# EAGLE design em_probe (EAGLE 6.2)
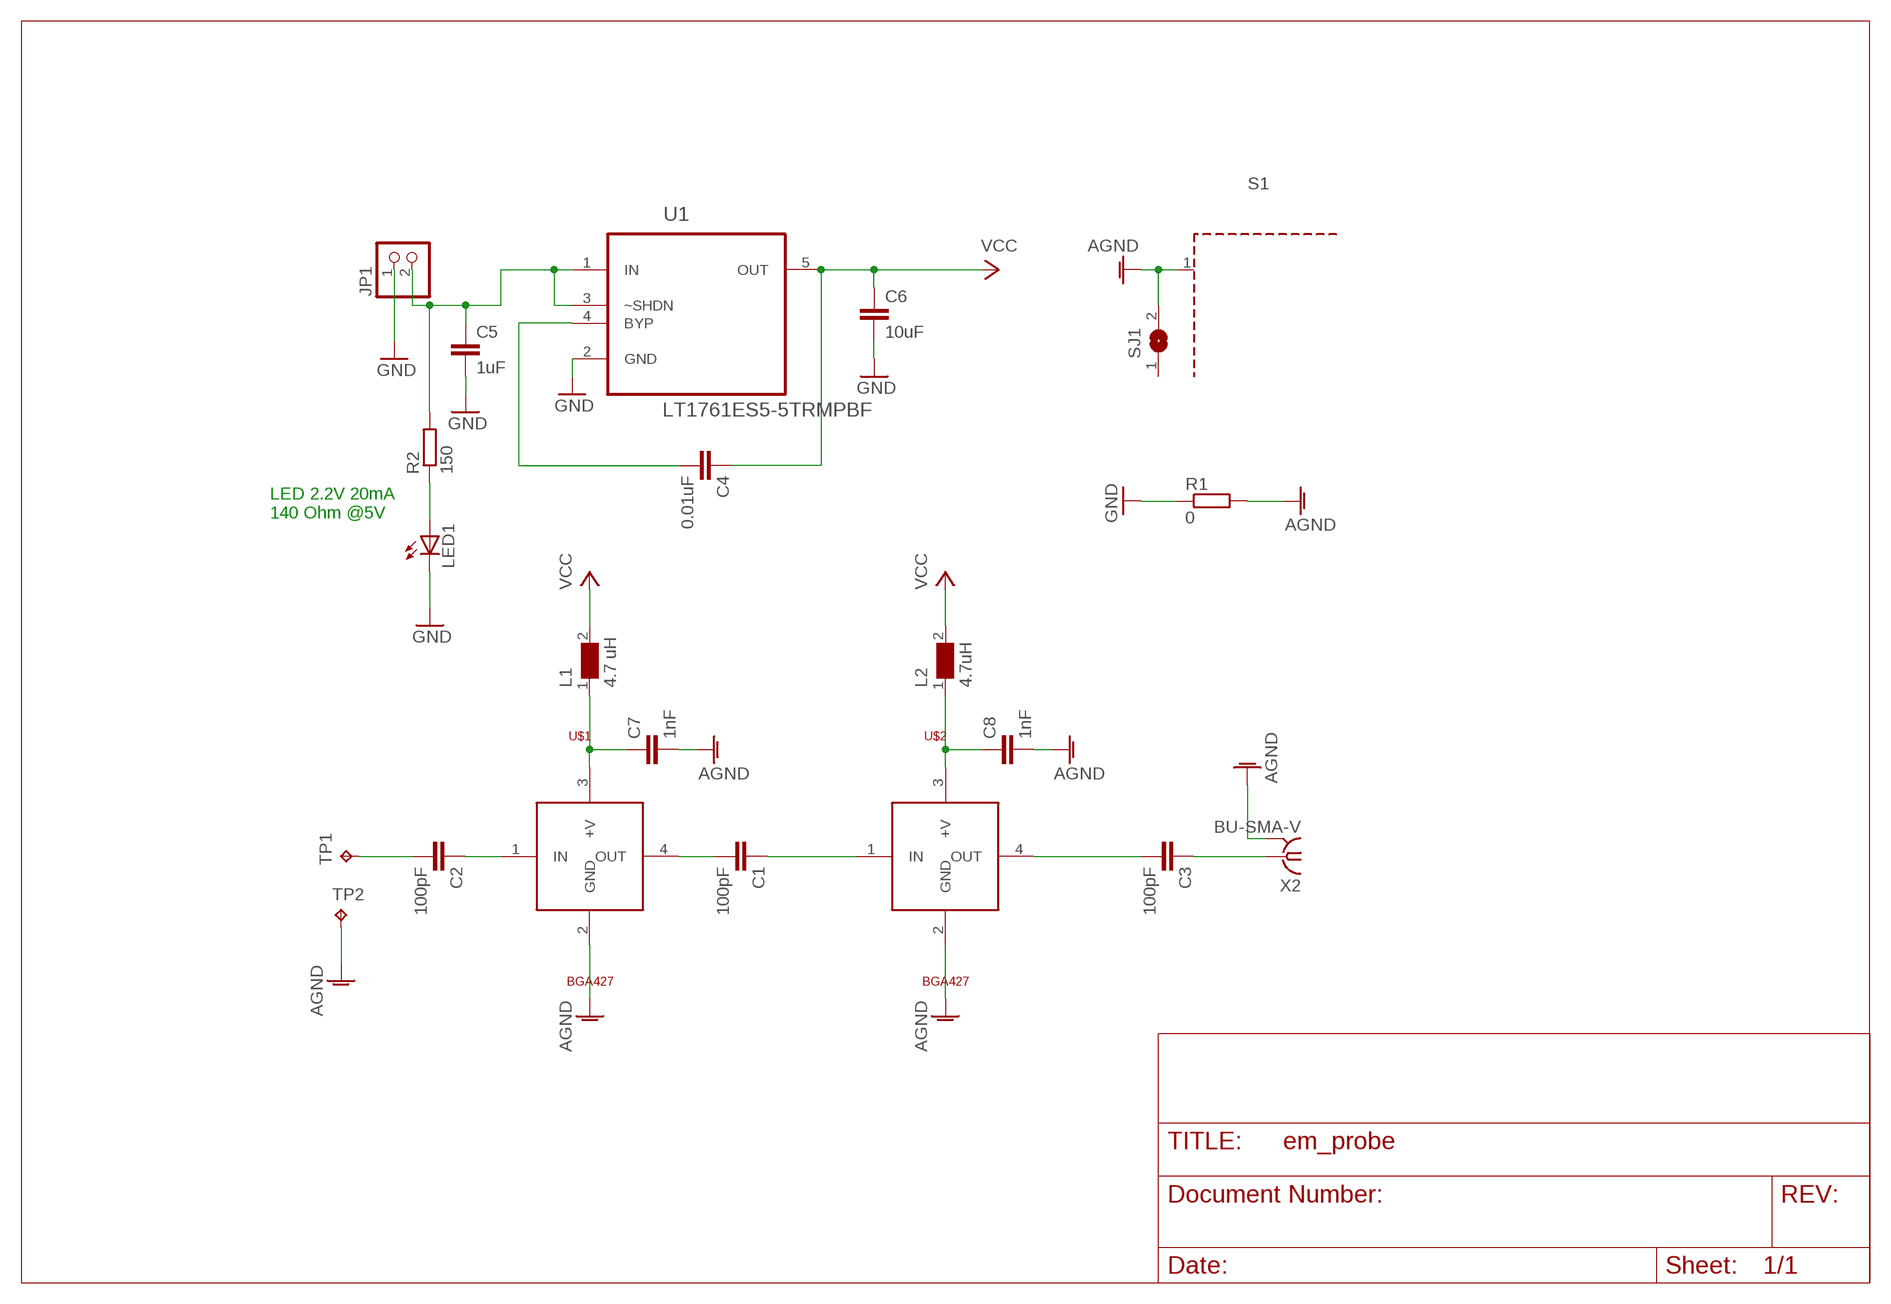
[diagram p0: schematic, sheet 1]

## Parts
C1  100pF  C-EUC0805  [C0805]
C2  100pF  C-EUC0805  [C0805]
C3  100pF  C-EUC0805  [C0805]
C4  0.01uF  C-EUC0805  [C0805]
C5  1uF  C-EUC0805  [C0805]
C6  10uF  C-EUC0805  [C0805]
C7  1nF  C-EUC0805  [C0805]
C8  1nF  C-EUC0805  [C0805]
JP1  PINHD-1X2/90  [1X02/90]
L1  4.7 uH  WE-RFH-744758347A  [WE-RFH]
L2  4.7uH  WE-RFH-744758347A  [WE-RFH]
LED1  LEDCHIPLED_0805  [CHIPLED_0805]
R1  0  R-EU_R0805  [R0805]
R2  150  R-EU_R0805  [R0805]
S1  WE-SHC_36103305  [WE-SHC_36103305]
SJ1  SJ  [SJ]
TP1  TPTP15R  [TP15R]
TP2  TPTP15R  [TP15R]
U1  LT1761ES5-5TRMPBF  [SOT95P280X100-5N]
U$1  BGA427  [SOT343]
U$2  BGA427  [SOT343]
X2  BU-SMA-V  [BU-SMA-V]

## Nets
AGND: C7.2 C8.2 R1.2 S1.1(GND) SJ1.2 TP2.TP U$1.2(GND) U$2.2(GND) X2.2 X2.3 X2.4 X2.5
GND: C5.2 C6.2 JP1.1 LED1.C R1.1 U1.2(GND)
N$1: C2.1 U$1.1(IN)
N$2: C1.2 U$1.4(OUT)
N$3: C1.1 U$2.1(IN)
N$4: C3.2 U$2.4(OUT)
N$5: C3.1 X2.1
N$6: C5.1 JP1.2 R2.2 U1.1(IN) U1.3(~SHDN)
N$7: C4.2 U1.4(BYP)
N$8: C2.2 TP1.TP
N$10: C7.1 L1.1 U$1.3(+V)
N$11: C8.1 L2.1 U$2.3(+V)
N$12: LED1.A R2.1
VCC: C4.1 C6.1 L1.2 L2.2 U1.5(OUT)
Unconnected: SJ1.1

## Notes on the sheet
- LED 2.2V 20mA
  140 Ohm @5V

## Library data of the parts
C1-C8 = resistor:C-EU: CAPACITOR, European symbol
JP1 = pinhead:PINHD-1X2: PIN HEADER
L1 L2 = WE-RFH:WE-RFH: Ferrite SMD Inductance WE-RFH - Inductance tolerances of 5% - High thermal stability - Recommended solder profile: Reflow - Operating temperature: Ceramic -40°C to +125°C, Ferrite -40°C to +85°C -- Developed especially for RF applications -- Perfect for telecommunication applications; MPN: 744758347A; OC_FARNELL: 2066927; OC_NEWARK: 74T0861; PACKAGE: 1008A_RFH; SUPPLIER: Wuerth Elektronik
LED1 = led:LED: LED OSRAM: - CHIPLED LG R971, LG N971, LY N971, LG Q971, LY Q971, LO R971, LY R971 LH N974, LH R974 LS Q976, LO Q976, LY Q976 LO Q996 - Hyper CHIPLED LW Q18S LB Q993, LB Q99A, LB R99A - SideLED LS A670, LO A670, LY A670, LG A670, LP A670 LB A673, LV A673, LT A673, LW A673 LH A674 LY A675 LS A676, LA A676, LO A676, LY A676, LW A676 LS A679, LY A679, LG A679 - Hyper Micro SIDELED® LS Y876, LA Y876, LO Y876, LY Y876 LT Y87S - SmartLED LW L88C, LW L88S LB L89C, LB L89S, LG L890 LS L89K, LO L89K, LY L89K LS L896, LA L896, LO L896, LY L896 - TOPLED LS T670, LO T670, LY T670, LG T670, LP T670 LSG T670, LSP T670, LSY T670, LOP T670, LYG T670 LG T671, LOG T671, LSG T671 LB T673, LV T673, LT T673, LW T673 LH T674 LS T676, LA T676, LO T676, LY T676, LB T676, LH T676, LSB T676, LW T676 LB T67C, LV T67C, LT T67C, LS T67K, LO T67K, LY T67K, LW E67C LS E67B, LA E67B, LO E67B, LY E67B, LB E67C, LV E67C, LT E67C LW T67C LS T679, LY T679, LG T679 LS T770, LO T770, LY T770, LG T770, LP T770 LB T773, LV T773, LT T773, LW T773 LH T774 LS E675, LA E675, LY E675, LS T675 LS T776, LA T776, LO T776, LY T776, LB T776 LHGB T686 LT T68C, LB T68C - Hyper Mini TOPLED® LB M676 - Mini TOPLED Santana® LG M470 LS M47K, LO M47K, LY M47K Source: http://www.osram.convergy.de LUXEON: - LUMILED® LXK2-PW12-R00, LXK2-PW12-S00, LXK2-PW14-U00, LXK2-PW14-V00 LXK2-PM12-R00, LXK2-PM12-S00, LXK2-PM14-U00 LXK2-PE12-Q00, LXK2-PE12-R00, LXK2-PE12-S00, LXK2-PE14-T00, LXK2-PE14-U00 LXK2-PB12-K00, LXK2-PB12-L00, LXK2-PB12-M00, LXK2-PB14-N00, LXK2-PB14-P00, LXK2-PB14-Q00 LXK2-PR12-L00, LXK2-PR12-M00, LXK2-PR14-Q00, LXK2-PR14-R00 LXK2-PD12-Q00, LXK2-PD12-R00, LXK2-PD12-S00 LXK2-PH12-R00, LXK2-PH12-S00 LXK2-PL12-P00, LXK2-PL12-Q00, LXK2-PL12-R00 Source: www.luxeon.com KINGBRIGHT: KA-3528ASYC Source: www.kingbright.com
R1 R2 = resistor:R-EU_: RESISTOR, European symbol
S1 = WE-SHC:WE-SHC: WE-SHC Shielding cabinet; MPN: 36103305; OC_FARNELL: 1909663; OC_NEWARK: 58T2482; PACKAGE: Frame_SMD; SUPPLIER: Wuerth Elektronik
SJ1 = jumper:SJ: SMD solder JUMPER
TP1 TP2 = testpad:TP: Test pad
U1 = em-parts:LT1761ES5-5TRMPBF: 100mA, Low Noise, LDO Micropower Regulators; MPN: LT1761ES5-5#TRMPBF; OC_FARNELL: 1663780; OC_NEWARK: 19P0922; PACKAGE: SOT-23-5; SUPPLIER: Linear Technology
U$1 U$2 = em-parts:BGA427
X2 = con-coax:BU-SMA-V: FEMALE SMA CONNECTOR Radiall distributor RS 112-3794; OC_FARNELL: unknown; OC_NEWARK: unknown

## Board
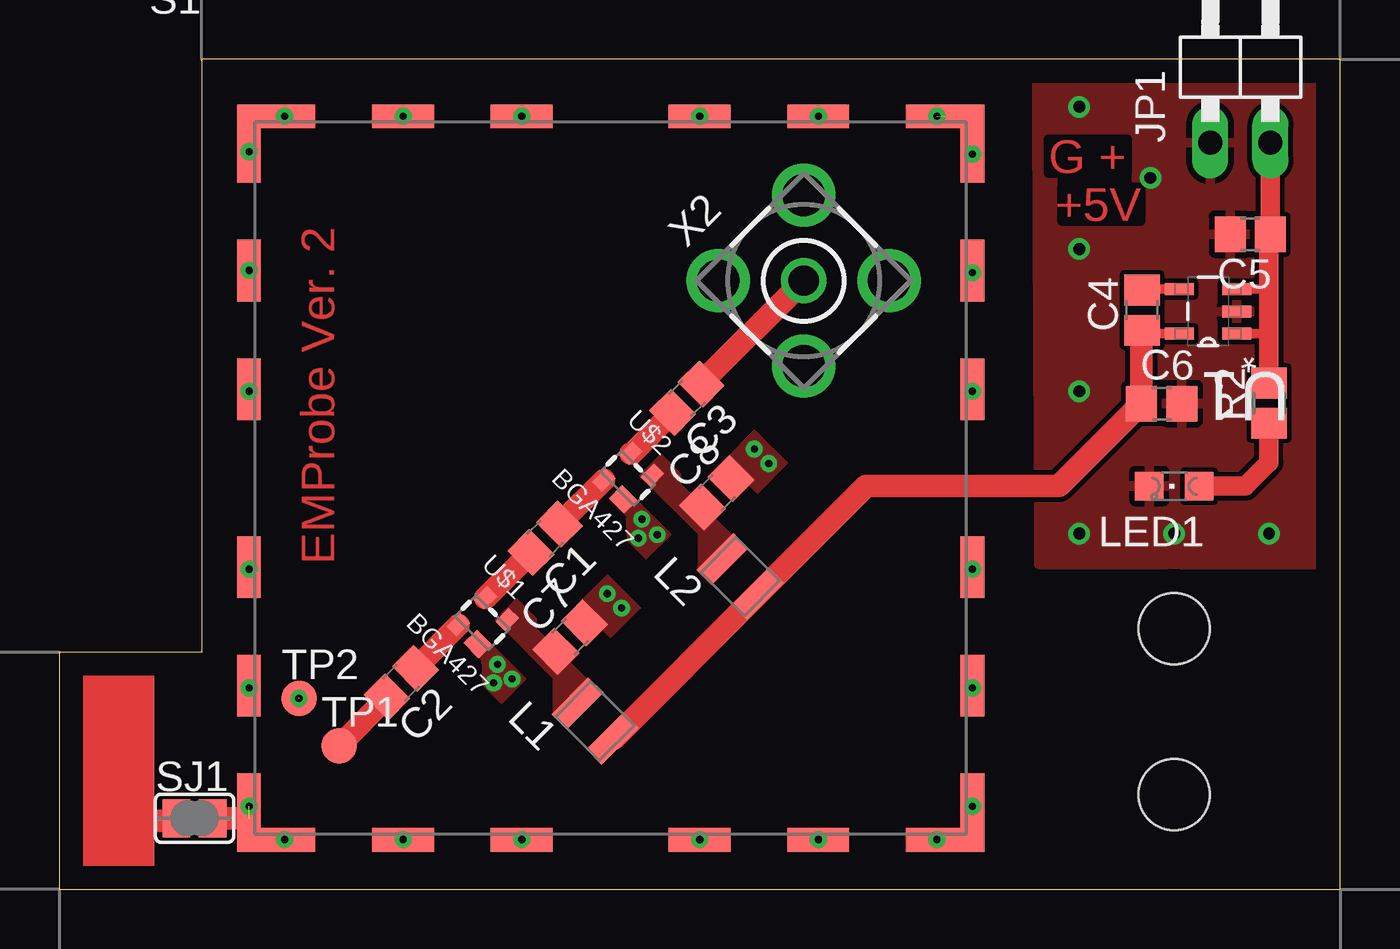
[diagram p1: board, top side]
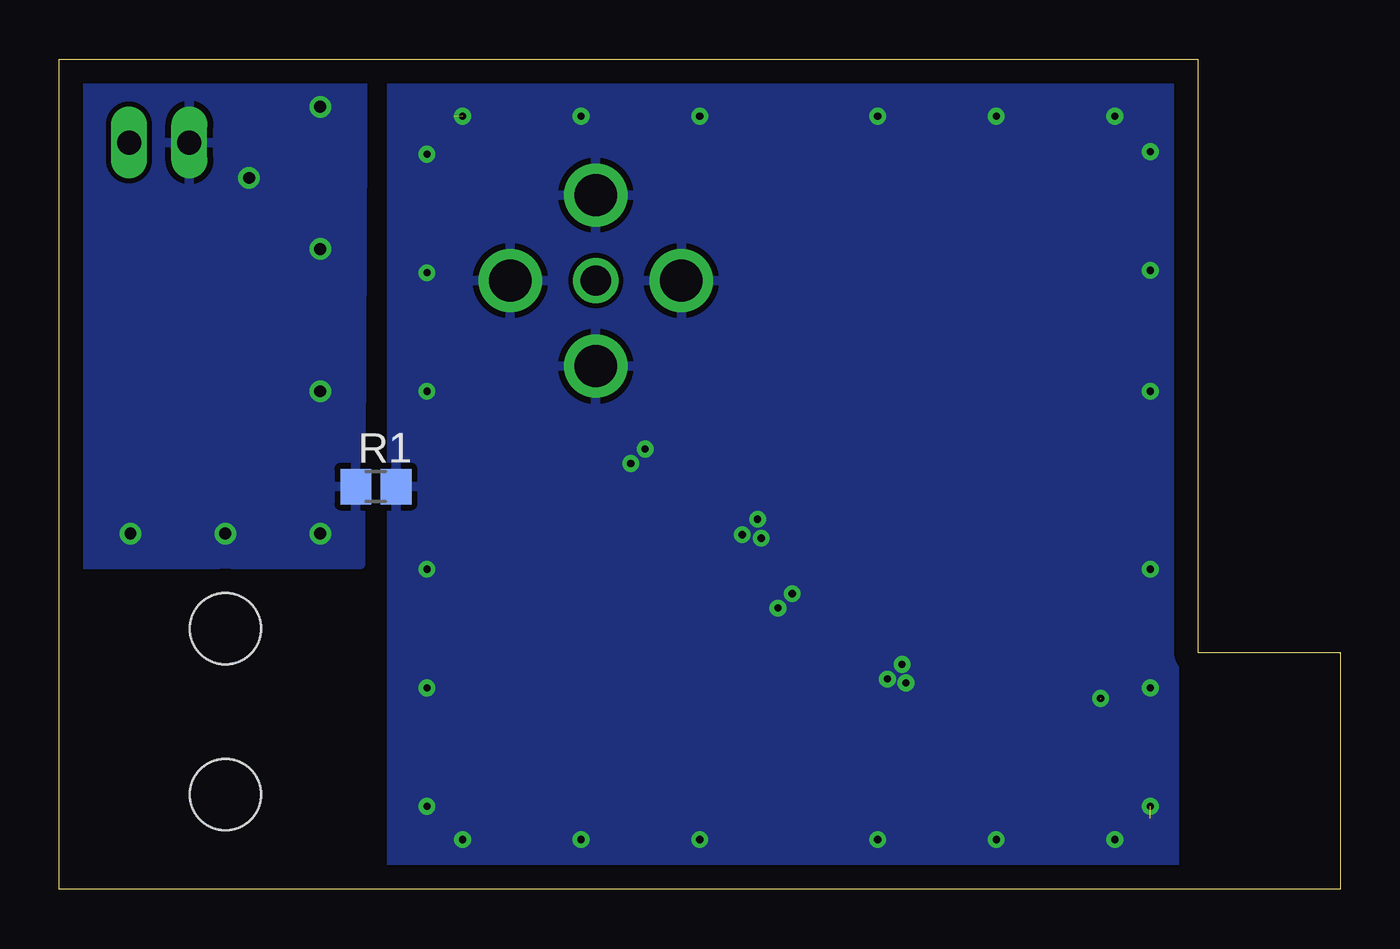
[diagram p2: board, bottom side, seen from below]

Size 54 x 35 mm. Coordinates in mm from the lower left corner, seen from the top.
Outline: 0,0 54,0 54,35 6,35 6,10 0,10 0,0
Copper layers (1*16): Top 0.035mm / dielectric 1.5mm / Bottom 0.035mm
Design rules: minimum track width 10mil, minimum drill 24mil, track to track 8mil, track to pad 8mil, pad to pad 8mil, via to via 8mil, smd to smd 8mil, copper to edge 40mil, drill to drill 8mil, minimum pad ring 10mil, minimum via ring 8mil, stop-mask expansion 4mil, vias tented up to drill 0.6mm, thermal gap 10mil
Holes 3 mm at 47,11 47,4
Milling: 6 lines

### Footprints (pad centres in the part's own frame; a part is rotated, then mirrored left to right if it is on the bottom)
C0805 = smd 1.3 x 1.5: 1 -0.85,0; 2 0.85,0
1X02/90 = drill 1.016 long: 1 -1.27,-3.81; 2 1.27,-3.81
WE-RFH = smd 0.9 x 2.2: 1 -1.05,0; 2 1.05,0
CHIPLED_0805 = smd 1.2 x 1.2: A 0,-1.05; C 0,1.05
R0805 = smd 1.3 x 1.5: 1 -0.85,0; 2 0.85,0
WE-SHC_36103305 = smd 3.3 x 1: 1 14.1,15.25; 8 14.1,-15.25; 13 -14.1,-15.25; 20 -14.1,15.25 | smd 1 x 3.3: 2 15.25,14.1; 7 15.25,-14.1; 14 -15.25,-14.1; 19 -15.25,14.1 | smd 1 x 2.6: 3 15.25,8.75; 4 15.25,3.75; 5 15.25,-3.75; 6 15.25,-8.75; 15 -15.25,-8.75; 16 -15.25,-3.75; 17 -15.25,3.75; 18 -15.25,8.75 | smd 2.6 x 1: 9 8.75,-15.25; 10 3.75,-15.25; 11 -3.75,-15.25; 12 -8.75,-15.25; 21 -8.75,15.25; 22 -3.75,15.25; 23 3.75,15.25; 24 8.75,15.25
SJ = smd 1.168 x 1.6: 1 -0.762,0; 2 0.762,0
TP15R = smd 1.5 x 1.5: TP 0,0
SOT95P280X100-5N = smd 1.219 x 0.508: 1 -1.219,0.94; 2 -1.219,0; 3 -1.219,-0.94; 4 1.219,-0.94; 5 1.219,0.94
SOT343 = smd 0.6 x 0.8: 1 -0.7,-0.8; 3 0.6,0.8; 4 -0.7,0.8 | smd 0.9 x 0.8: 2 0.45,-0.8
BU-SMA-V = drill 1.27: 1 0,0 | drill 1.778: 2 -2.55,2.55; 3 2.55,2.55; 4 2.55,-2.55; 5 -2.55,-2.55

### Placement (x,y rotation side)
C1  20.48,14.8 225 top
C2  14.41,8.73 225 top
C3  26.46,20.71 225 top
C4  45.64,24.42 90 top
C5  50.21,27.62 180 top
C6  46.47,20.48 0 top
C7  21.54,10.64 45 top
C8  27.72,16.72 45 top
JP1  49.79,35.3 0 top
L1  22.58,7.1 315 top
L2  28.71,13.19 315 top
LED1  47,17 90 top
R1  40.65,16.98 0 bottom
R2  51,20.5 90 top
S1  23.24,17.34 0 top
SJ1  5.7,3 0 top
TP1  11.79,6.06 0 top
TP2  10.11,8.06 0 top
U1  48.43,24.37 180 top
U$1  17.89,11.23 315 top
U$2  24.02,17.33 315 top
X2  31.38,25.67 45 top

### Tracks (layer width: path | path; a pad name or v marks a point on that pad's centre or on a via)
AGND  (via drill 0.3, 0.3 pad 0.5)  (3 unrouted)
  Top 0.955: SJ1.2 8,3
  other vias: 9.5,32.6 14.5,32.6 19.5,32.6 27,32.6 32,32.6 37,32.6 38.5,31 38.5,26 38.5,21 38.5,13.5 38.5,8.5 38.5,3.5 37,2.1 32,2.1 27,2.1 19.5,2.1 14.5,2.1 9.5,2.1 8,3.5 8,8.5 8,13.5 8,21 8,26.1 8,31.1 19.09,8.87 18.47,9.48 18.31,8.71 10.1,8.05 23.1,12.47 23.71,11.86 24.41,14.81 24.56,15.61 25.21,14.96 29.3,18.57 29.91,17.96
  pour Bottom: 7,-1 7,37 40,37 40,-1
  pour Top (no thermals): 17.79,9.65 17.86,8.59 18.64,7.81 19.7,8.87 18.15,10.42 17.58,9.86
  pour Top (no thermals): 23.23,10.57 24.53,11.87 23.11,13.28 21.82,11.99
  pour Top (no thermals): 23.89,15.75 23.96,14.69 24.74,13.91 25.8,14.97 24.25,16.52 23.68,15.96
  pour Top (no thermals): 29.43,16.67 30.73,17.97 29.31,19.38 28.02,18.09
GND  (via drill 0.5)
  other vias: 43,33 46,30 43,27 43,21 51,15 47,15 43,15
  pour Bottom: 53.8,13.7 41.3,13.7 41.2,36.4 53.7,36.4
  pour Top: 41.3,13.7 54.8,13.7 54.7,37.4 41.2,37.4
N$1
  Top 0.955: U$1.1 16.83,11.14 C2.1
N$2
  Top 0.955: U$1.4 17.98,12.29 C1.2
N$3
  Top 0.955: C1.1 21.1,15.4 U$2.1
N$4
  Top 0.955: U$2.4 24.13,18.39 C3.2
N$5
  Top 0.955: C3.1 27.06,21.34 X2.1
N$6
  Top 0.406: U1.1 51,23.43 51,23 | U1.3 51,25.31 51,25
  Top 0.813: JP1.2 C5.1 51,27.62 51,25 51,23 R2.2
N$7
  Top 0.406: U1.4 45.64,25.31 C4.2
N$8
  Top 0.955: C2.2 13.81,8.08 TP1.TP
N$9
  Top 0.955: 4.9,2.9 3.5,2.9 3.5,3
N$10
  pour Top (no thermals): 18.35,11.35 20.83,8.88 20.83,7.46 20.9,7.39 22.31,8.81 20.12,11 20.12,11.42 19.27,12.27
N$11
  pour Top (no thermals): 24.45,17.45 26.93,14.98 26.93,13.56 27,13.49 28.41,14.91 26.22,17.1 26.22,17.52 25.37,18.37
N$12
  Top 0.813: LED1.A 50,17 51,18 R2.1
VCC
  Top 0.406: U1.5 45.64,23.43 C4.1
  Top 0.955: L1.2 23.36,6.36 L2.2 | L2.2 | L2.2 34,17 42.14,17 C6.1 45.62,23.55 C4.1
(copper drawn outside any net)
  shapes: Top area x1

### Text on the board
Top: G + | +5V | EMProbe Ver. 2